# EasyEDA schematic SCH_base02-portenta-pcb-backup01_2021-12-06.json
TITLE: Portenta Base Shield; REV: 1.0; Date: 2021-09-13; Sheet: 1/1; Drawn By: rocksetta; Company: Rocksetta
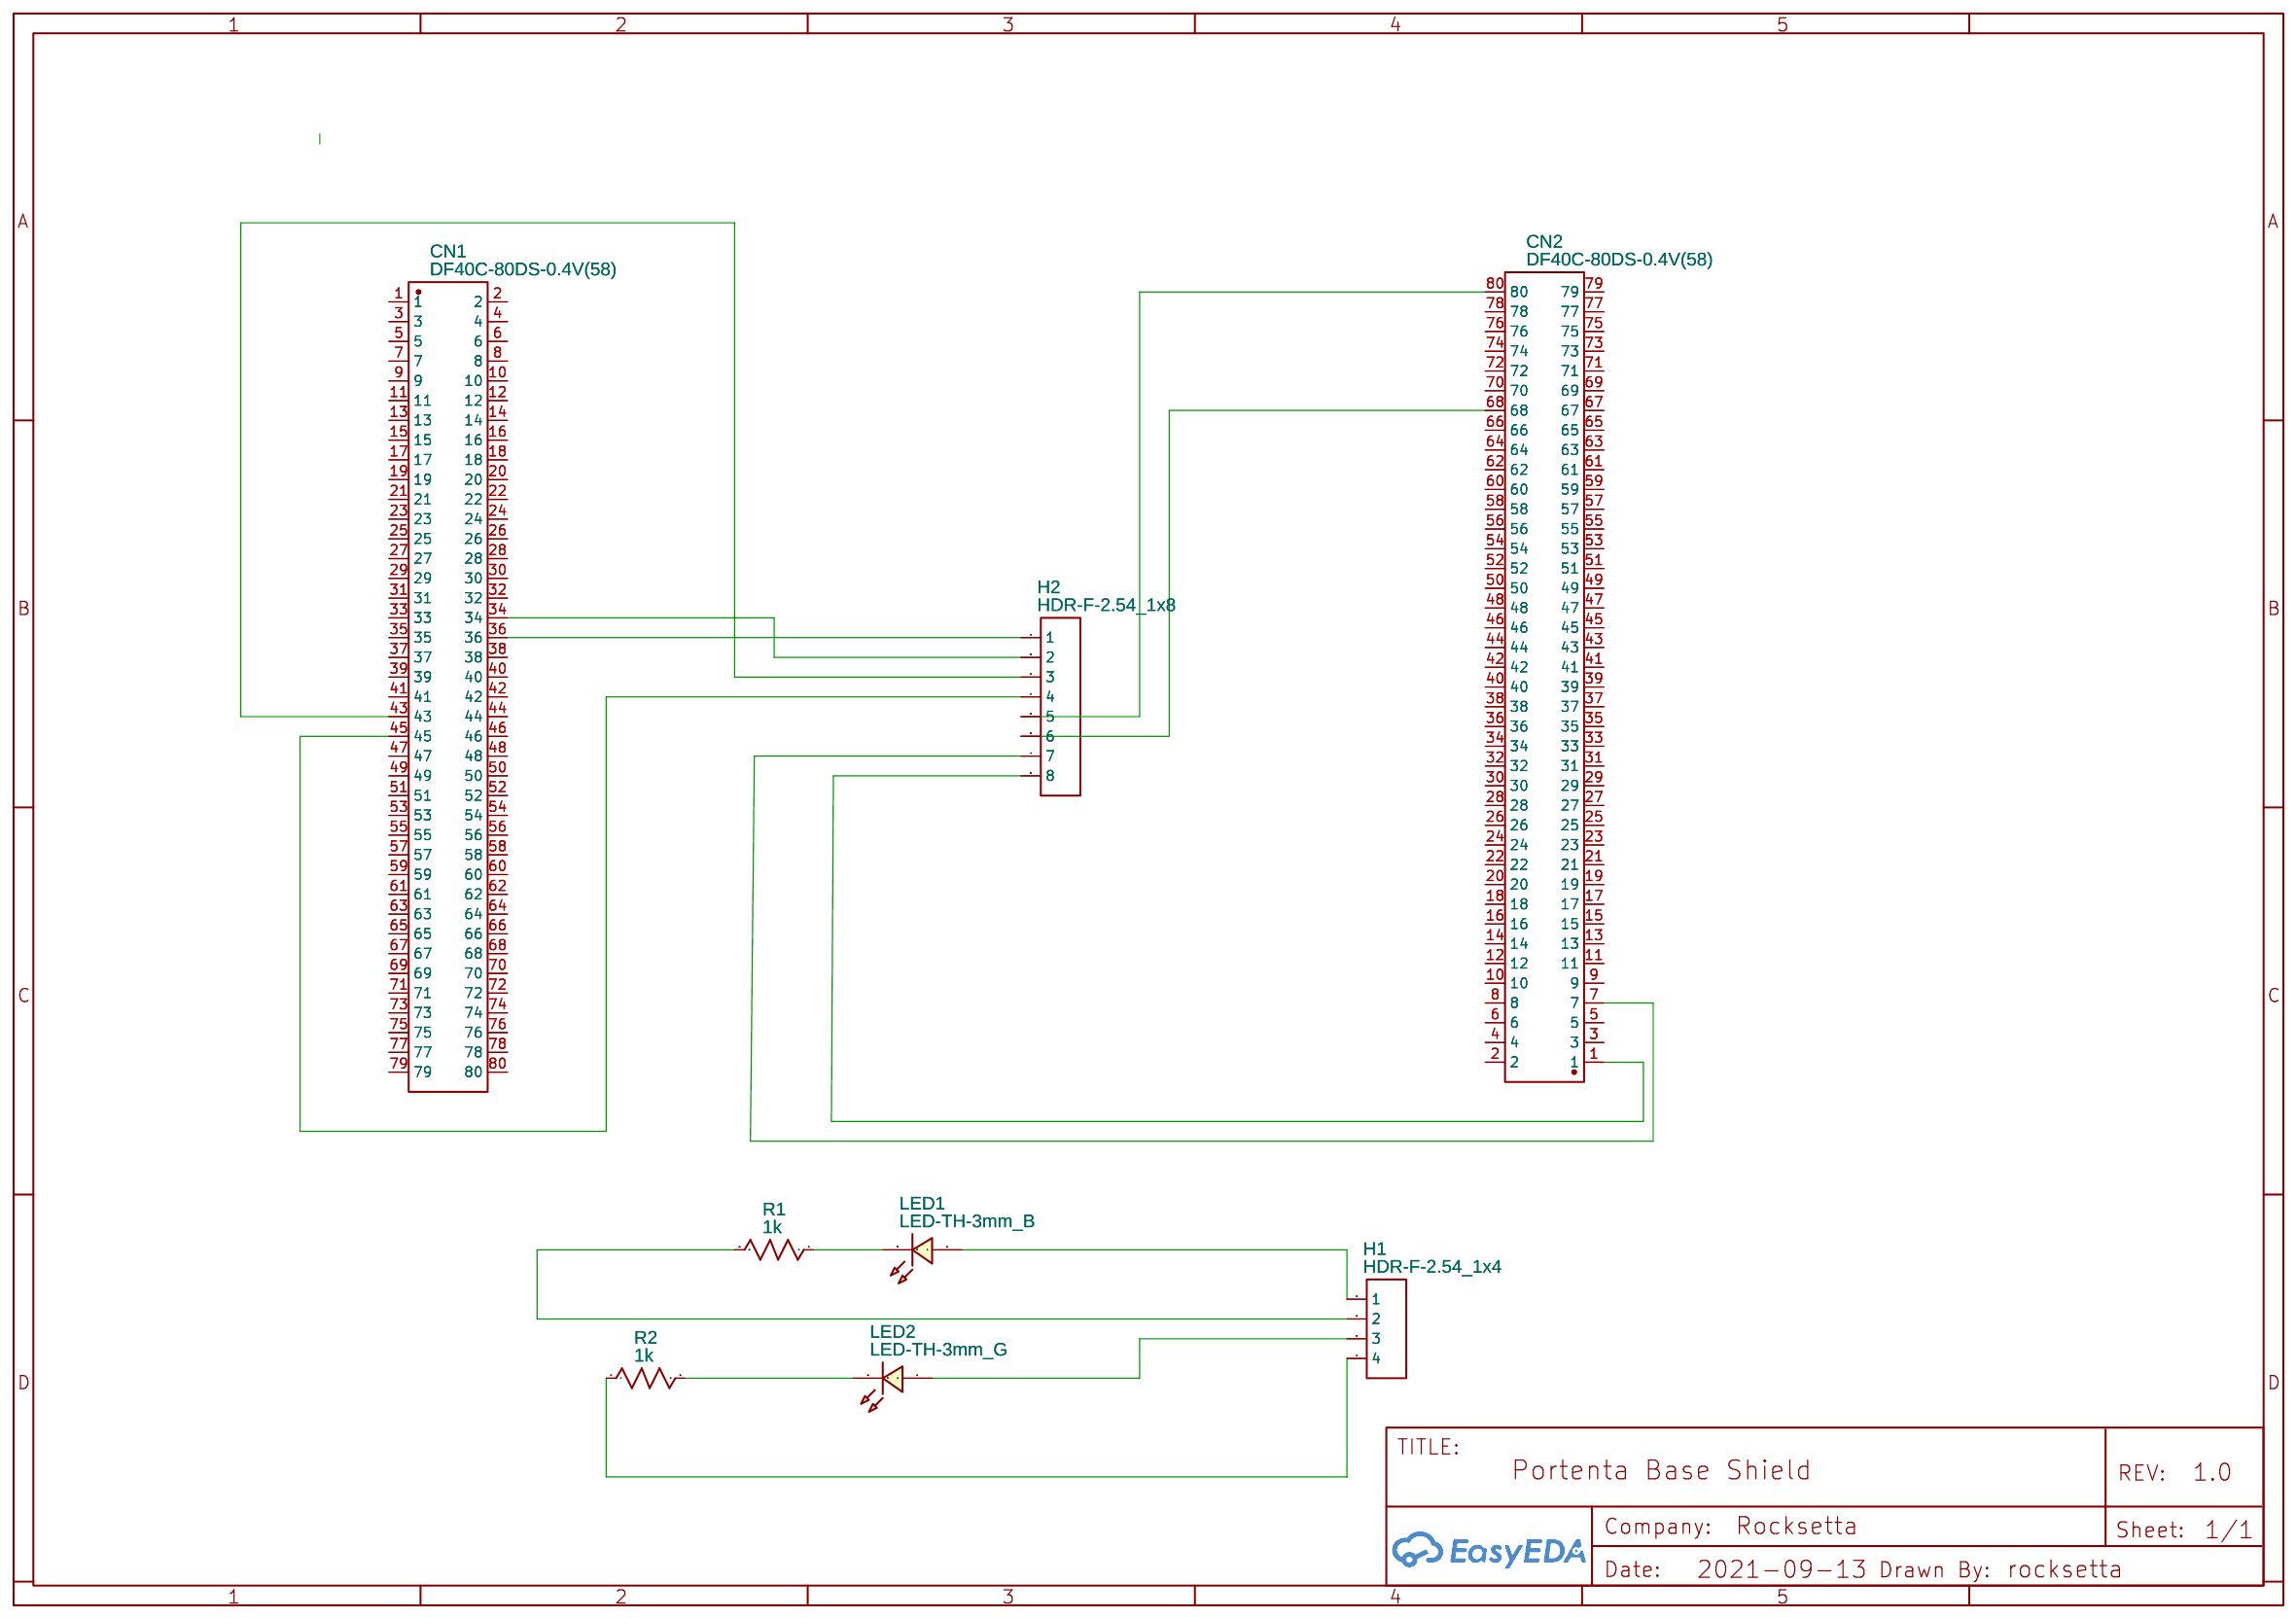
[diagram p0: schematic sheet]

## Parts
CN1  DF40C-80DS-0.4V(58)  [CONN-SMD_DF40C-80DS-0.4V-58]
CN2  DF40C-80DS-0.4V(58)  [CONN-SMD_DF40C-80DS-0.4V-58]
H1  HDR-F-2.54_1x4  [HDR-F-2.54_1X4]
H2  HDR-F-2.54_1x8  [HDR-F-2.54_1X8]
LED1  LED-TH-3mm_B  [LED-TH_BD3.0_BLUE]
LED2  LED-TH-3mm_G  [LED-TH_BD3.0_GREEN]
R1  1k  [R1206]
R2  1k  [R1206]

## Library data of the parts
CN1 CN2 = DF40C-80DS-0.4V(58): Supplier: LCSC; Supplier Part: C597941; Manufacturer: HRS(Hirose); Contributor: JLCPCB_Official; link: http://www.farnell.com/datasheets/2691051.pdf
H1 = HDR-F-2.54_1x4: Supplier Part: C225501; Supplier: LCSC; Contributor: LCEDA_Lib
H2 = HDR-F-2.54_1x8: Supplier Part: C225505; Supplier: LCSC; Contributor: LCEDA_Lib
LED1 = LED-TH-3mm_B: Manufacturer: EVERLIGHT(台湾亿光); Manufacturer Part: 204-10SUBC/S400-A4; Supplier Part: C86881; Supplier: LCSC; Contributor: LCEDA_Lib
LED2 = LED-TH-3mm_G: Manufacturer: EVERLIGHT(台湾亿光); Manufacturer Part: 204-10SYGD/S530-E3; Supplier Part: C85161; Contributor: LCEDA_Lib
R1 R2 = R_1206_US: Contributor: LCEDA_Lib

## Nets
Net-(CN1-34): CN1.34 H2.2
Net-(CN1-36): CN1.36 H2.1
Net-(CN1-43): CN1.43 H2.3
Net-(CN1-45): CN1.45 H2.4
Net-(CN2-1): CN2.1 H2.8
Net-(CN2-7): CN2.7 H2.7
Net-(CN2-68): CN2.68 H2.6
Net-(CN2-80): CN2.80 H2.5
Net-(H1-1): H1.1 LED1.1
Net-(H1-2): H1.2 R1.2
Net-(H1-3): H1.3 LED2.1
Net-(H1-4): H1.4 R2.1
Net-(LED1-2): LED1.2 R1.1
Net-(LED2-2): LED2.2 R2.2

Not connected (* = marked no-connect by the designer): CN1 1 2 3 4 5 6 7 8 9 10 11 12 13 14 15 16 17 18 19 20 21 22 23 24 25 26 27 28 29 30 31 32 33 35 37 38 39 40 41 42 44 46 47 48 49 50 51 52 53 54 55 56 57 58 59 60 61 62 63 64 65 66 67 68 69 70 71 72 73 74 75 76 77 78 79 80; CN2 2 3 4 5 6 8 9 10 11 12 13 14 15 16 17 18 19 20 21 22 23 24 25 26 27 28 29 30 31 32 33 34 35 36 37 38 39 40 41 42 43 44 45 46 47 48 49 50 51 52 53 54 55 56 57 58 59 60 61 62 63 64 65 66 67 69 70 71 72 73 74 75 76 77 78 79
